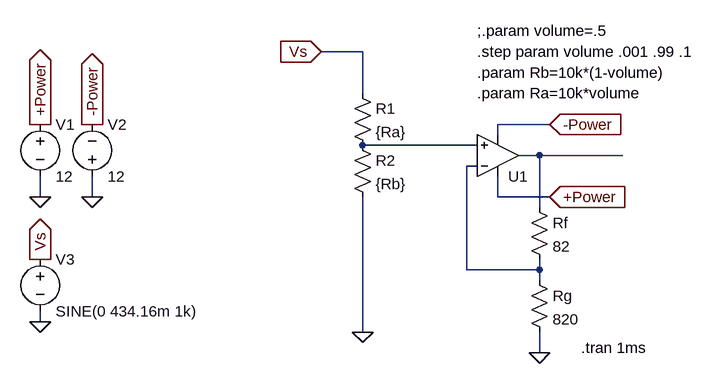
[diagram p0: schematic Fader.asc]
Fader.asc, the LTspice schematic file:
Version 4.1
SHEET 1 960 680
WIRE 192 64 128 64
WIRE 192 128 192 64
WIRE 480 176 400 176
WIRE 400 192 400 176
WIRE 368 208 192 208
WIRE 464 224 432 224
WIRE 592 224 464 224
WIRE 368 240 352 240
WIRE -304 288 -304 256
WIRE -224 288 -224 256
WIRE 400 288 400 256
WIRE 480 288 400 288
WIRE 464 304 464 224
WIRE 352 400 352 240
WIRE 464 400 464 384
WIRE 464 400 352 400
WIRE 464 416 464 400
WIRE -304 480 -304 464
WIRE 192 496 192 288
WIRE 464 528 464 496
FLAG 464 528 0
FLAG 192 496 0
FLAG 480 176 -Power
IOPIN 480 176 In
FLAG 480 288 +Power
IOPIN 480 288 In
FLAG 128 64 Vs
IOPIN 128 64 In
FLAG -304 176 +Power
IOPIN -304 176 Out
FLAG -224 176 -Power
IOPIN -224 176 Out
FLAG -304 288 0
FLAG -224 288 0
FLAG -304 480 0
FLAG -304 384 Vs
IOPIN -304 384 Out
SYMBOL OpAmps\\UniversalOpAmp 400 224 M180
SYMATTR InstName U1
SYMBOL res 448 288 R0
SYMATTR InstName Rf
SYMATTR Value 82
SYMBOL res 448 400 R0
SYMATTR InstName Rg
SYMATTR Value 820
SYMBOL voltage -304 160 R0
WINDOW 123 0 0 Left 0
WINDOW 39 0 0 Left 0
SYMATTR InstName V1
SYMATTR Value 12
SYMBOL voltage -224 272 M180
WINDOW 0 24 96 Left 2
WINDOW 3 24 16 Left 2
WINDOW 123 0 0 Left 0
WINDOW 39 0 0 Left 0
SYMATTR InstName V2
SYMATTR Value 12
SYMBOL voltage -304 368 R0
WINDOW 123 0 0 Left 0
WINDOW 39 0 0 Left 0
SYMATTR InstName V3
SYMATTR Value SINE(0 434.16m 1k)
SYMBOL res 176 112 R0
SYMATTR InstName R1
SYMATTR Value {Ra}
SYMBOL res 176 192 R0
SYMATTR InstName R2
SYMATTR Value {Rb}
TEXT 368 32 Left 2 !;.param volume=.5
TEXT 528 520 Left 2 !.tran 1ms
TEXT 368 64 Left 2 !.step param volume .001 .99 .1
TEXT 368 96 Left 2 !.param Rb=10k*(1-volume)
TEXT 368 128 Left 2 !.param Ra=10k*volume

The netlist it stands for:
* Fader.asc
X§U1 N001 N003 +Power -Power N002 level1 Avol=1Meg GBW=10Meg Vos=0 En=0 Enk=0 In=0 Ink=0 Rin=500Meg  ; pins In+ In- V+ V- OUT
Rf N002 N003 82
Rg N003 0 820
V1 +Power 0 12
V2 0 -Power 12
V3 Vs 0 SINE(0 434.16m 1k)
R1 Vs N001 {Ra}
R2 N001 0 {Rb}
;.param volume=.5
.tran 1ms
.step param volume .001 .99 .1
.param Rb=10k*(1-volume)
.param Ra=10k*volume
.lib UniversalOpAmp1.lib
.backanno
.end